# Altium schematic sheet Game_Console_LCD.SchDoc
size A4
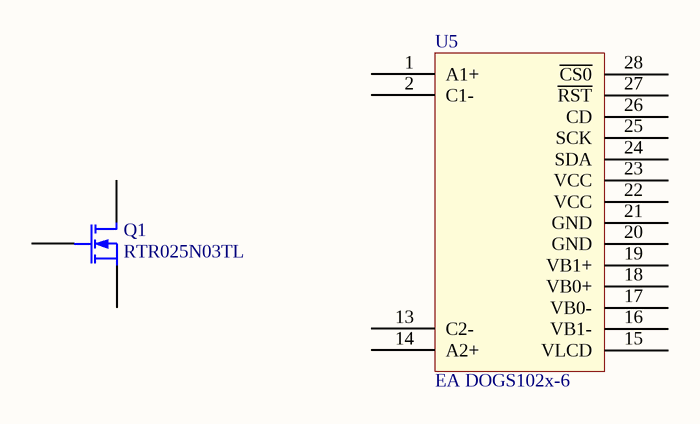
[diagram p0: Game_Console_LCD.SchDoc]

## Parts
Q1  RTR025N03TL  [SOT23]
U5  EA DOGS102x-6  [EA DOGS102x]

## Nets

Not connected (* = marked no-connect by the designer): Q1 1 2 3; U5 1(A1+) 2(C1-) 3 4 5 6 7 8 9 10 11 12 13(C2-) 14(A2+) 15(VLCD) 16(VB1-) 17(VB0-) 18(VB0+) 19(VB1+) 20(GND) 21(GND) 22(VCC) 23(VCC) 24(SDA) 25(SCK) 26(CD) 27(~{RST}) 28(~{CS0})

## Library data of the parts
Q1 = MOSFET-N: N-Channel MOSFET; PackageDocument: 1995/1996; Published: 8-Jun-2000; LatestRevisionDate: 17-Jul-2002; LatestRevisionNote: Re-released for DXP Platform.; PackageReference: E3; Publisher: Altium Limited
U5 = EA DOGS102x-6: LCD 102x64-pixel with backlight